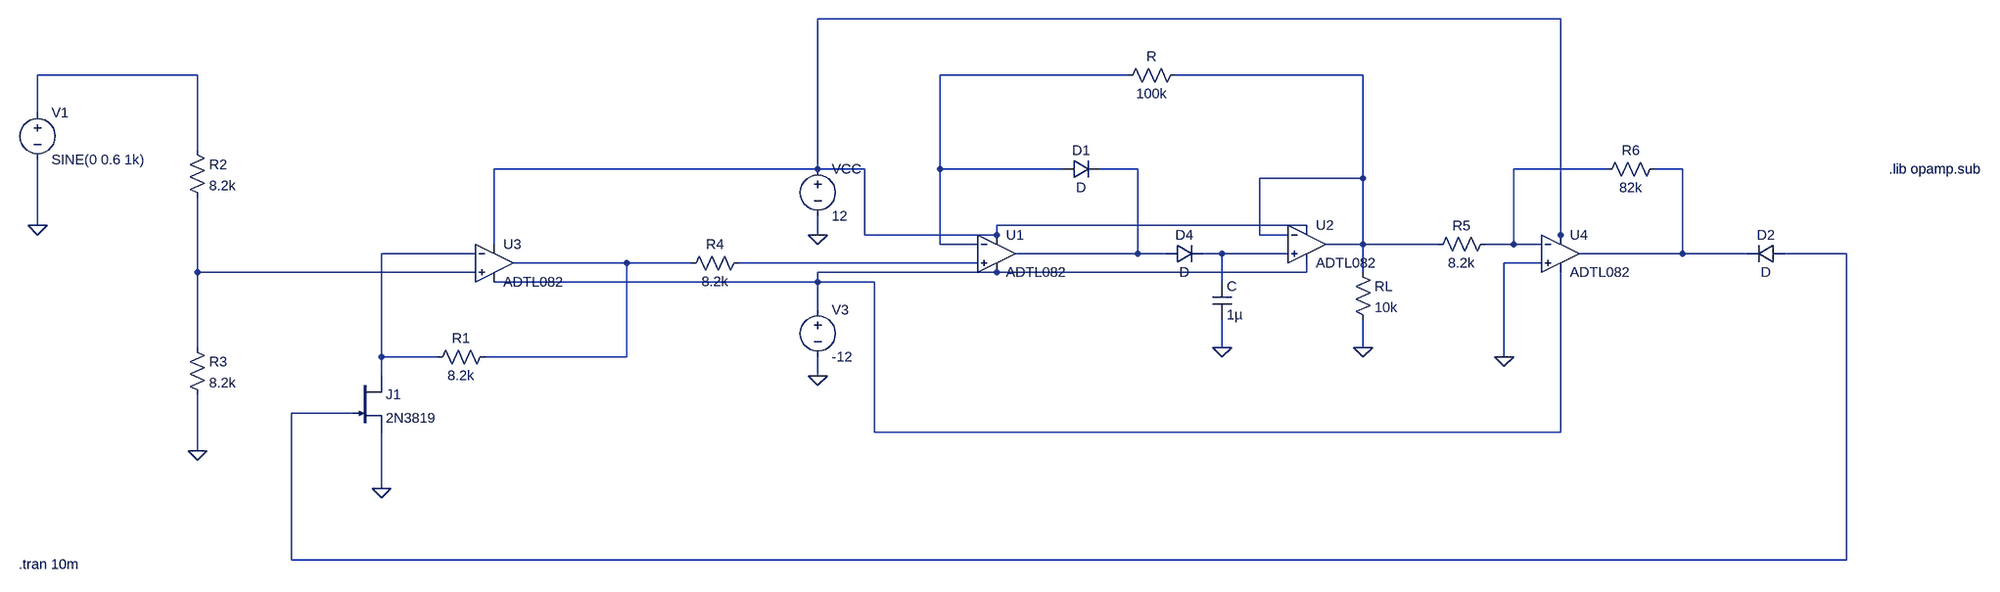
[diagram p0: schematic AGC.asc]
AGC.asc, the LTspice schematic file:
Version 4.1
SHEET 1 3092 680
WIRE 1072 -592 -384 -592
WIRE -1792 -496 -2064 -496
WIRE 336 -496 16 -496
WIRE 736 -496 416 -496
WIRE -2064 -432 -2064 -496
WIRE -1792 -368 -1792 -496
WIRE -384 -336 -384 -592
WIRE -384 -336 -1200 -336
WIRE -304 -336 -384 -336
WIRE 16 -336 16 -496
WIRE 224 -336 16 -336
WIRE 352 -336 288 -336
WIRE 1152 -336 992 -336
WIRE 1280 -336 1232 -336
WIRE 736 -320 736 -496
WIRE 736 -320 560 -320
WIRE -2064 -240 -2064 -352
WIRE 640 -240 112 -240
WIRE -384 -224 -384 -256
WIRE -304 -224 -304 -336
WIRE 112 -224 112 -240
WIRE 112 -224 -304 -224
WIRE 560 -224 560 -320
WIRE 608 -224 560 -224
WIRE 1072 -224 1072 -592
WIRE -1200 -208 -1200 -336
WIRE 16 -208 16 -336
WIRE 80 -208 16 -208
WIRE 736 -208 736 -320
WIRE 736 -208 672 -208
WIRE 864 -208 736 -208
WIRE 992 -208 992 -336
WIRE 992 -208 944 -208
WIRE 1040 -208 992 -208
WIRE 1072 -208 1072 -224
WIRE -1232 -192 -1392 -192
WIRE 352 -192 352 -336
WIRE 352 -192 144 -192
WIRE 400 -192 352 -192
WIRE 496 -192 464 -192
WIRE 608 -192 496 -192
WIRE 1280 -192 1280 -336
WIRE 1280 -192 1104 -192
WIRE 1440 -192 1280 -192
WIRE 1776 -192 1504 -192
WIRE -944 -176 -1168 -176
WIRE -704 -176 -944 -176
WIRE 80 -176 -624 -176
WIRE 1040 -176 976 -176
WIRE -1792 -160 -1792 -288
WIRE -1232 -160 -1792 -160
WIRE 112 -160 -384 -160
WIRE 640 -160 640 -176
WIRE 640 -160 112 -160
WIRE 736 -160 736 -208
WIRE -384 -144 -384 -160
WIRE -384 -144 -1200 -144
WIRE -288 -144 -384 -144
WIRE 496 -144 496 -192
WIRE -384 -96 -384 -144
WIRE -1792 -32 -1792 -160
WIRE 496 -32 496 -80
WIRE 736 -32 736 -80
WIRE -1392 -16 -1392 -192
WIRE -1296 -16 -1392 -16
WIRE -944 -16 -944 -176
WIRE -944 -16 -1216 -16
WIRE 976 -16 976 -176
WIRE -1392 16 -1392 -16
WIRE -384 16 -384 -16
WIRE -1440 80 -1632 80
WIRE -288 112 -288 -144
WIRE 1072 112 1072 -160
WIRE 1072 112 -288 112
WIRE -1792 144 -1792 48
WIRE -1392 208 -1392 112
WIRE -1632 656 -1632 80
WIRE 1776 656 1776 -192
WIRE 1776 656 -1632 656
FLAG 736 -32 0
FLAG 496 -32 0
FLAG -384 16 0
FLAG -384 -224 0
FLAG -1392 208 0
FLAG -1792 144 0
FLAG -2064 -240 0
FLAG 976 -16 0
SYMBOL diode 400 -176 R270
WINDOW 0 32 32 VTop 2
WINDOW 3 0 32 VBottom 2
SYMATTR InstName D4
SYMBOL diode 224 -320 R270
WINDOW 0 32 32 VTop 2
WINDOW 3 0 32 VBottom 2
SYMATTR InstName D1
SYMBOL res 432 -512 R90
WINDOW 0 0 56 VBottom 2
WINDOW 3 32 56 VTop 2
SYMATTR InstName R
SYMATTR Value 100k
SYMBOL res 720 -176 R0
SYMATTR InstName RL
SYMATTR Value 10k
SYMBOL cap 480 -144 R0
SYMATTR InstName C
SYMATTR Value 1µ
SYMBOL voltage -384 -352 R0
SYMATTR InstName VCC
SYMATTR Value 12
SYMBOL voltage -384 -112 R0
SYMATTR InstName V3
SYMATTR Value -12
SYMBOL njf -1440 16 R0
SYMATTR InstName J1
SYMATTR Value 2N3819
SYMBOL res -1200 -32 R90
WINDOW 0 0 56 VBottom 2
WINDOW 3 32 56 VTop 2
SYMATTR InstName R1
SYMATTR Value 8.2k
SYMBOL res -1808 -384 R0
SYMATTR InstName R2
SYMATTR Value 8.2k
SYMBOL res -1808 -48 R0
SYMATTR InstName R3
SYMATTR Value 8.2k
SYMBOL voltage -2064 -448 R0
WINDOW 123 0 0 Left 0
WINDOW 39 0 0 Left 0
SYMATTR InstName V1
SYMATTR Value SINE(0 0.6 1k)
SYMBOL res -608 -192 R90
WINDOW 0 0 56 VBottom 2
WINDOW 3 32 56 VTop 2
SYMATTR InstName R4
SYMATTR Value 8.2k
SYMBOL res 960 -224 R90
WINDOW 0 0 56 VBottom 2
WINDOW 3 32 56 VTop 2
SYMATTR InstName R5
SYMATTR Value 8.2k
SYMBOL res 1248 -352 R90
WINDOW 0 0 56 VBottom 2
WINDOW 3 32 56 VTop 2
SYMATTR InstName R6
SYMATTR Value 82k
SYMBOL diode 1504 -208 R90
WINDOW 0 0 32 VBottom 2
WINDOW 3 32 32 VTop 2
SYMATTR InstName D2
SYMBOL OpAmps\\ADTL082 112 -256 R0
SYMATTR InstName U1
SYMBOL OpAmps\\ADTL082 640 -272 R0
SYMATTR InstName U2
SYMBOL OpAmps\\ADTL082 -1200 -240 R0
SYMATTR InstName U3
SYMBOL OpAmps\\ADTL082 1072 -256 R0
SYMATTR InstName U4
TEXT -2096 664 Left 2 !.tran 10m
TEXT 1848 -336 Left 2 !.lib opamp.sub

The netlist it stands for:
* AGC.asc
D4 N005 N009 D
D1 N003 N005 D
R N004 N003 100k
RL N004 0 10k
C N009 0 1µ
VCC N001 0 12
V3 N014 0 -12
J1 N008 N010 0 2N3819
R1 N011 N008 8.2k
R2 N002 N013 8.2k
R3 N013 0 8.2k
V1 N002 0 SINE(0 0.6 1k)
R4 N012 N011 8.2k
R5 N006 N004 8.2k
R6 N007 N006 82k
D2 N010 N007 D
X§U1 N012 N003 N001 N014 N005 ADTL082  ; pins In+ In- V+ V- OUT
X§U2 N009 N004 N001 N014 N004 ADTL082  ; pins In+ In- V+ V- OUT
X§U3 N013 N008 N001 N014 N011 ADTL082  ; pins In+ In- V+ V- OUT
X§U4 0 N006 N001 N014 N007 ADTL082  ; pins In+ In- V+ V- OUT
.model D D
.lib standard.dio
.model NJF NJF
.model PJF PJF
.lib standard.jft
.tran 10m
.lib opamp.sub
.lib ADI.lib
.backanno
.end